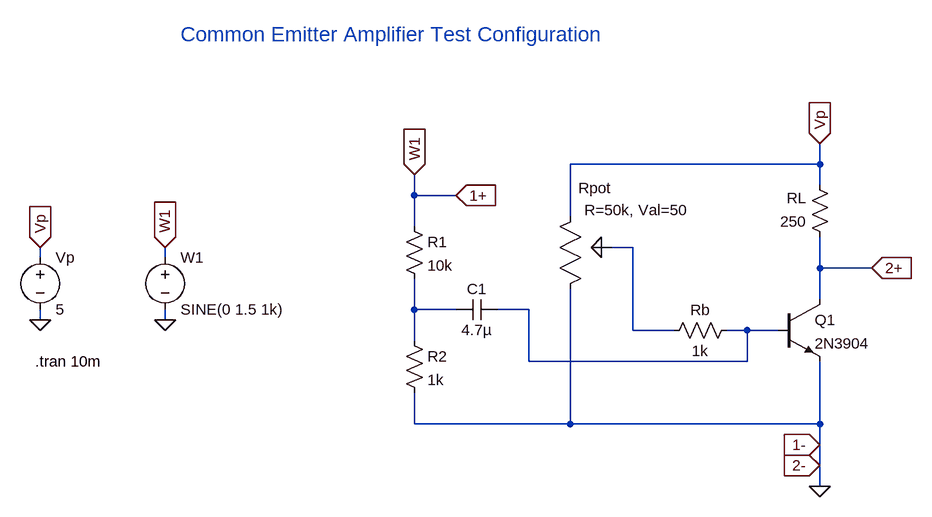
[diagram p0: schematic ce_amp_test_confic.asc]
ce_amp_test_confic.asc, the LTspice schematic file:
Version 4
SHEET 1 1492 792
WIRE 1312 256 1312 224
WIRE 1312 256 928 256
WIRE 1312 288 1312 256
WIRE 688 304 688 272
WIRE 752 304 688 304
WIRE 928 336 928 256
WIRE 688 352 688 304
WIRE 1024 384 992 384
WIRE 112 400 112 384
WIRE 304 400 304 384
WIRE 1312 416 1312 368
WIRE 1392 416 1312 416
WIRE 1312 464 1312 416
WIRE 688 480 688 432
WIRE 752 480 688 480
WIRE 864 480 816 480
WIRE 112 496 112 480
WIRE 304 496 304 480
WIRE 1024 512 1024 384
WIRE 1088 512 1024 512
WIRE 1200 512 1168 512
WIRE 1248 512 1200 512
WIRE 688 528 688 480
WIRE 864 560 864 480
WIRE 1200 560 1200 512
WIRE 1200 560 864 560
WIRE 688 656 688 608
WIRE 928 656 928 448
WIRE 928 656 688 656
WIRE 1312 656 1312 560
WIRE 1312 656 928 656
WIRE 1312 688 1312 656
WIRE 1312 720 1312 688
WIRE 1312 752 1312 720
FLAG 1312 752 0
FLAG 1312 224 Vp
IOPIN 1312 224 In
FLAG 688 272 W1
IOPIN 688 272 In
FLAG 752 304 1+
IOPIN 752 304 In
FLAG 1392 416 2+
IOPIN 1392 416 In
FLAG 1312 720 2-
IOPIN 1312 720 In
FLAG 112 496 0
FLAG 304 496 0
FLAG 112 384 Vp
IOPIN 112 384 In
FLAG 304 384 W1
IOPIN 304 384 In
FLAG 1312 688 1-
IOPIN 1312 688 In
SYMBOL res 672 336 R0
SYMATTR InstName R1
SYMATTR Value 10k
SYMBOL res 672 512 R0
SYMATTR InstName R2
SYMATTR Value 1k
SYMBOL res 1184 496 R90
WINDOW 0 0 56 VBottom 2
WINDOW 3 32 56 VTop 2
SYMATTR InstName Rb
SYMATTR Value 1k
SYMBOL res 1328 384 R180
WINDOW 0 36 76 Left 2
WINDOW 3 36 40 Left 2
SYMATTR InstName RL
SYMATTR Value 250
SYMBOL potentiometer 944 352 M0
WINDOW 0 -47 -59 Left 2
WINDOW 39 -165 -25 Left 2
SYMATTR InstName Rpot
SYMBOL npn 1248 464 R0
SYMATTR InstName Q1
SYMATTR Value 2N3904
SYMBOL cap 816 464 R90
WINDOW 0 0 32 VBottom 2
WINDOW 3 32 32 VTop 2
SYMATTR InstName C1
SYMATTR Value 4.7µ
SYMBOL voltage 304 384 R0
WINDOW 123 0 0 Left 0
WINDOW 39 0 0 Left 0
SYMATTR InstName W1
SYMATTR Value SINE(0 1.5 1k)
SYMBOL voltage 112 384 R0
WINDOW 123 0 0 Left 0
WINDOW 39 0 0 Left 0
SYMATTR InstName Vp
SYMATTR Value 5
TEXT 328 56 Left 3 ;Common Emitter Amplifier Test Configuration
TEXT 104 560 Left 2 !.tran 10m

The netlist it stands for:
* ce_amp_test_confic.asc
R1 1+ N002 10k
R2 N002 0 1k
Rb N003 N001 1k
RL 2+ Vp 250
XRpot Vp N001 0 potentiometer R=50k, Val=50  ; pins 1 2 3
Q1 2+ N003 0 0 2N3904
C1 N003 N002 4.7µ
V§W1 1+ 0 SINE(0 1.5 1k)
Vp Vp 0 5
.model NPN NPN
.model PNP PNP
.lib standard.bjt
* Common Emitter Amplifier Test Configuration
.tran 10m
.backanno
.end